# Altium schematic sheet Motors.SchDoc
size A4
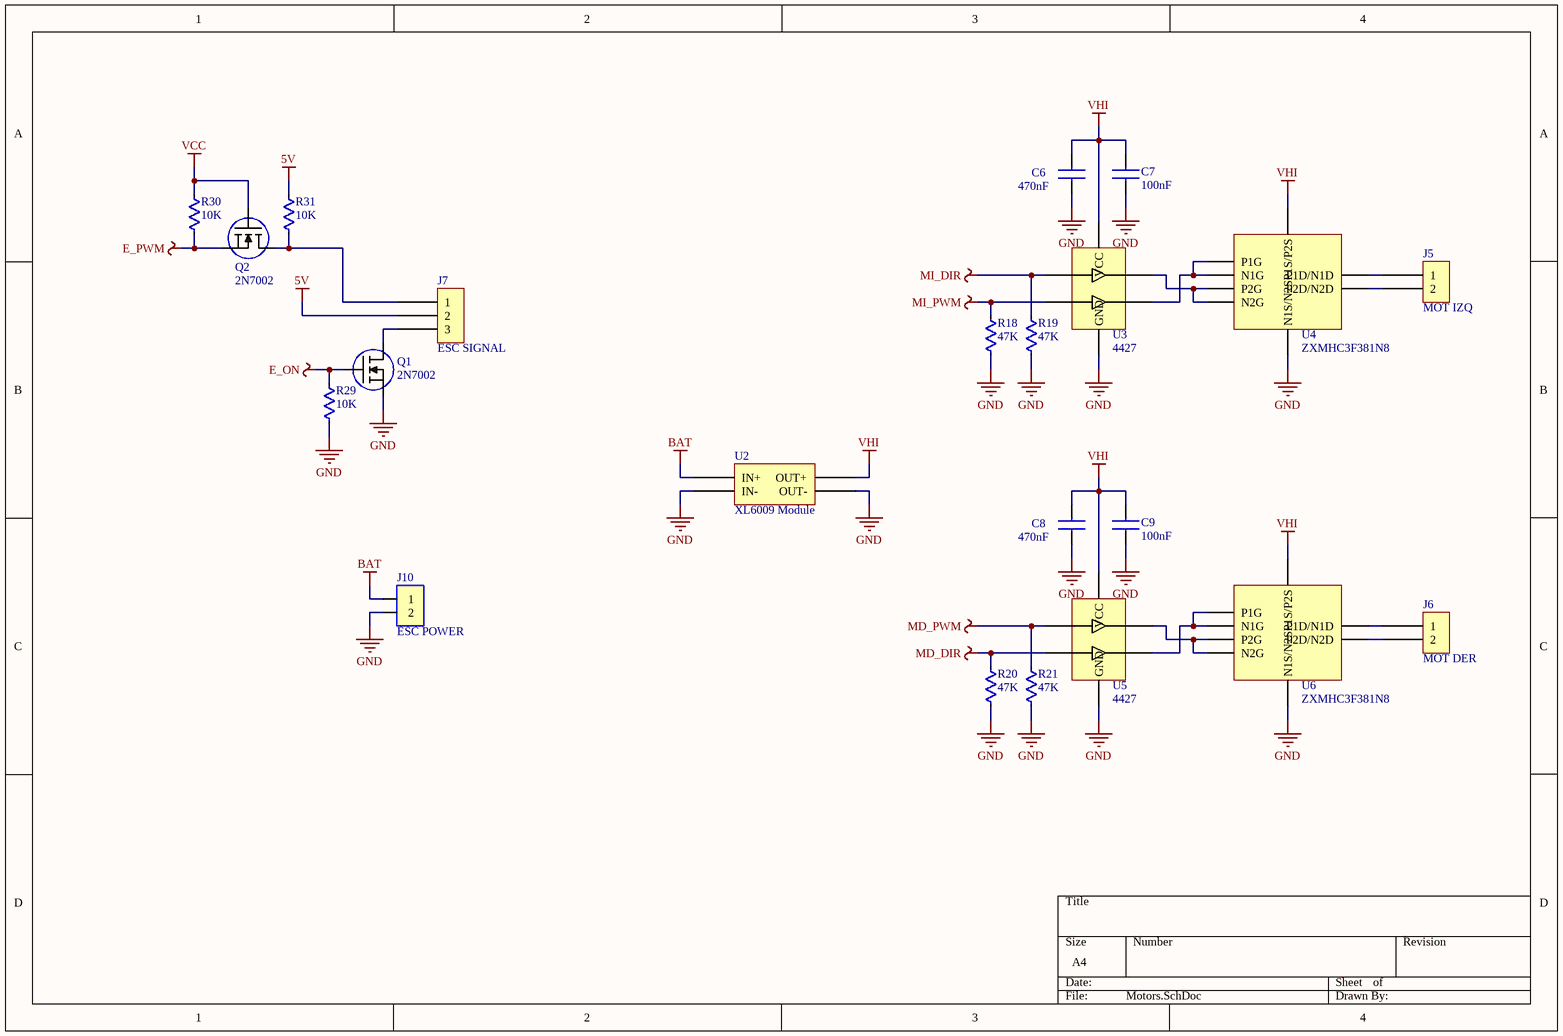
[diagram p0: Motors.SchDoc]

## Parts
C6  value 470nF  [C1206]  (hidden comment: CAP-CER)
C7  value 100nF  [C1206]  (hidden comment: CAP-CER)
C8  value 470nF  [C1206]  (hidden comment: CAP-CER)
C9  value 100nF  [C1206]  (hidden comment: CAP-CER)
J5  MOT IZQ  [HEADER 1x2]
J6  MOT DER  [HEADER 1x2]
J7  ESC SIGNAL  [Header 1x3]
J10  ESC POWER  [BLOCK_TERMINAL-2]
Q1  2N7002  [SOT-23]
Q2  2N7002  [SOT-23]
R18  value 47K  [R1206]  (hidden comment: RES)
R19  value 47K  [R1206]  (hidden comment: RES)
R20  value 47K  [R1206]  (hidden comment: RES)
R21  value 47K  [R1206]  (hidden comment: RES)
R29  value 10K  [R1206]  (hidden comment: RES)
R30  value 10K  [R1206]  (hidden comment: RES)
R31  value 10K  [R1206]  (hidden comment: RES)
U2  XL6009 Module  [XL6009 mdl]
U3  4427  [SOIC-8]
U4  ZXMHC3F381N8  [SOIC-8]
U5  4427  [SOIC-8]
U6  ZXMHC3F381N8  [SOIC-8]

## Nets
5V: J7.2 R31.2
BAT: J10.1 U2.0(IN+)
E_ON: Q1.G R29.2
E_PWM: Q2.S R30.1
GND: C6.1 C7.1 C8.1 C9.1 J10.2 Q1.S R18.1 R19.1 R20.1 R21.1 R29.1 U2.1(IN-) U2.2(OUT-) U3.3(GND) U4.3(N1S/N2S) U5.3(GND) U6.3(N1S/N2S)
MD_DIR: R20.2 U5.4(INB)
MD_PWM: R21.2 U5.2(INA)
MI_DIR: R19.2 U3.2(INA)
MI_PWM: R18.2 U3.4(INB)
VCC: Q2.G R30.2
VHI: C6.2 C7.2 C8.2 C9.2 U2.3(OUT+) U3.6(VCC) U4.7(P1S/P2S) U5.6(VCC) U6.7(P1S/P2S)
NetJ5_1: J5.1 U4.2(P1D/N1D)
NetJ5_2: J5.2 U4.6(P2D/N2D)
NetJ6_1: J6.1 U6.2(P1D/N1D)
NetJ6_2: J6.2 U6.6(P2D/N2D)
NetJ7_1: J7.1 Q2.D R31.1
NetJ7_3: J7.3 Q1.D
NetU3_5: U3.5(OUTB) U4.1(N1G) U4.8(P1G)
NetU3_7: U3.7(OUTA) U4.4(N2G) U4.5(P2G)
NetU5_5: U5.5(OUTB) U6.1(N1G) U6.8(P1G)
NetU5_7: U5.7(OUTA) U6.4(N2G) U6.5(P2G)

## Library data of the parts
J5 J6 = Header 1x2
J7 = Header 1x3
J10 = 2-BLOCK_TERMINAL
Q1 Q2 = N-MOSFET: pin to pad: D>C G>B S>E